# EAGLE design HenHouseControlleri2cfix (EAGLE 8.0.2)
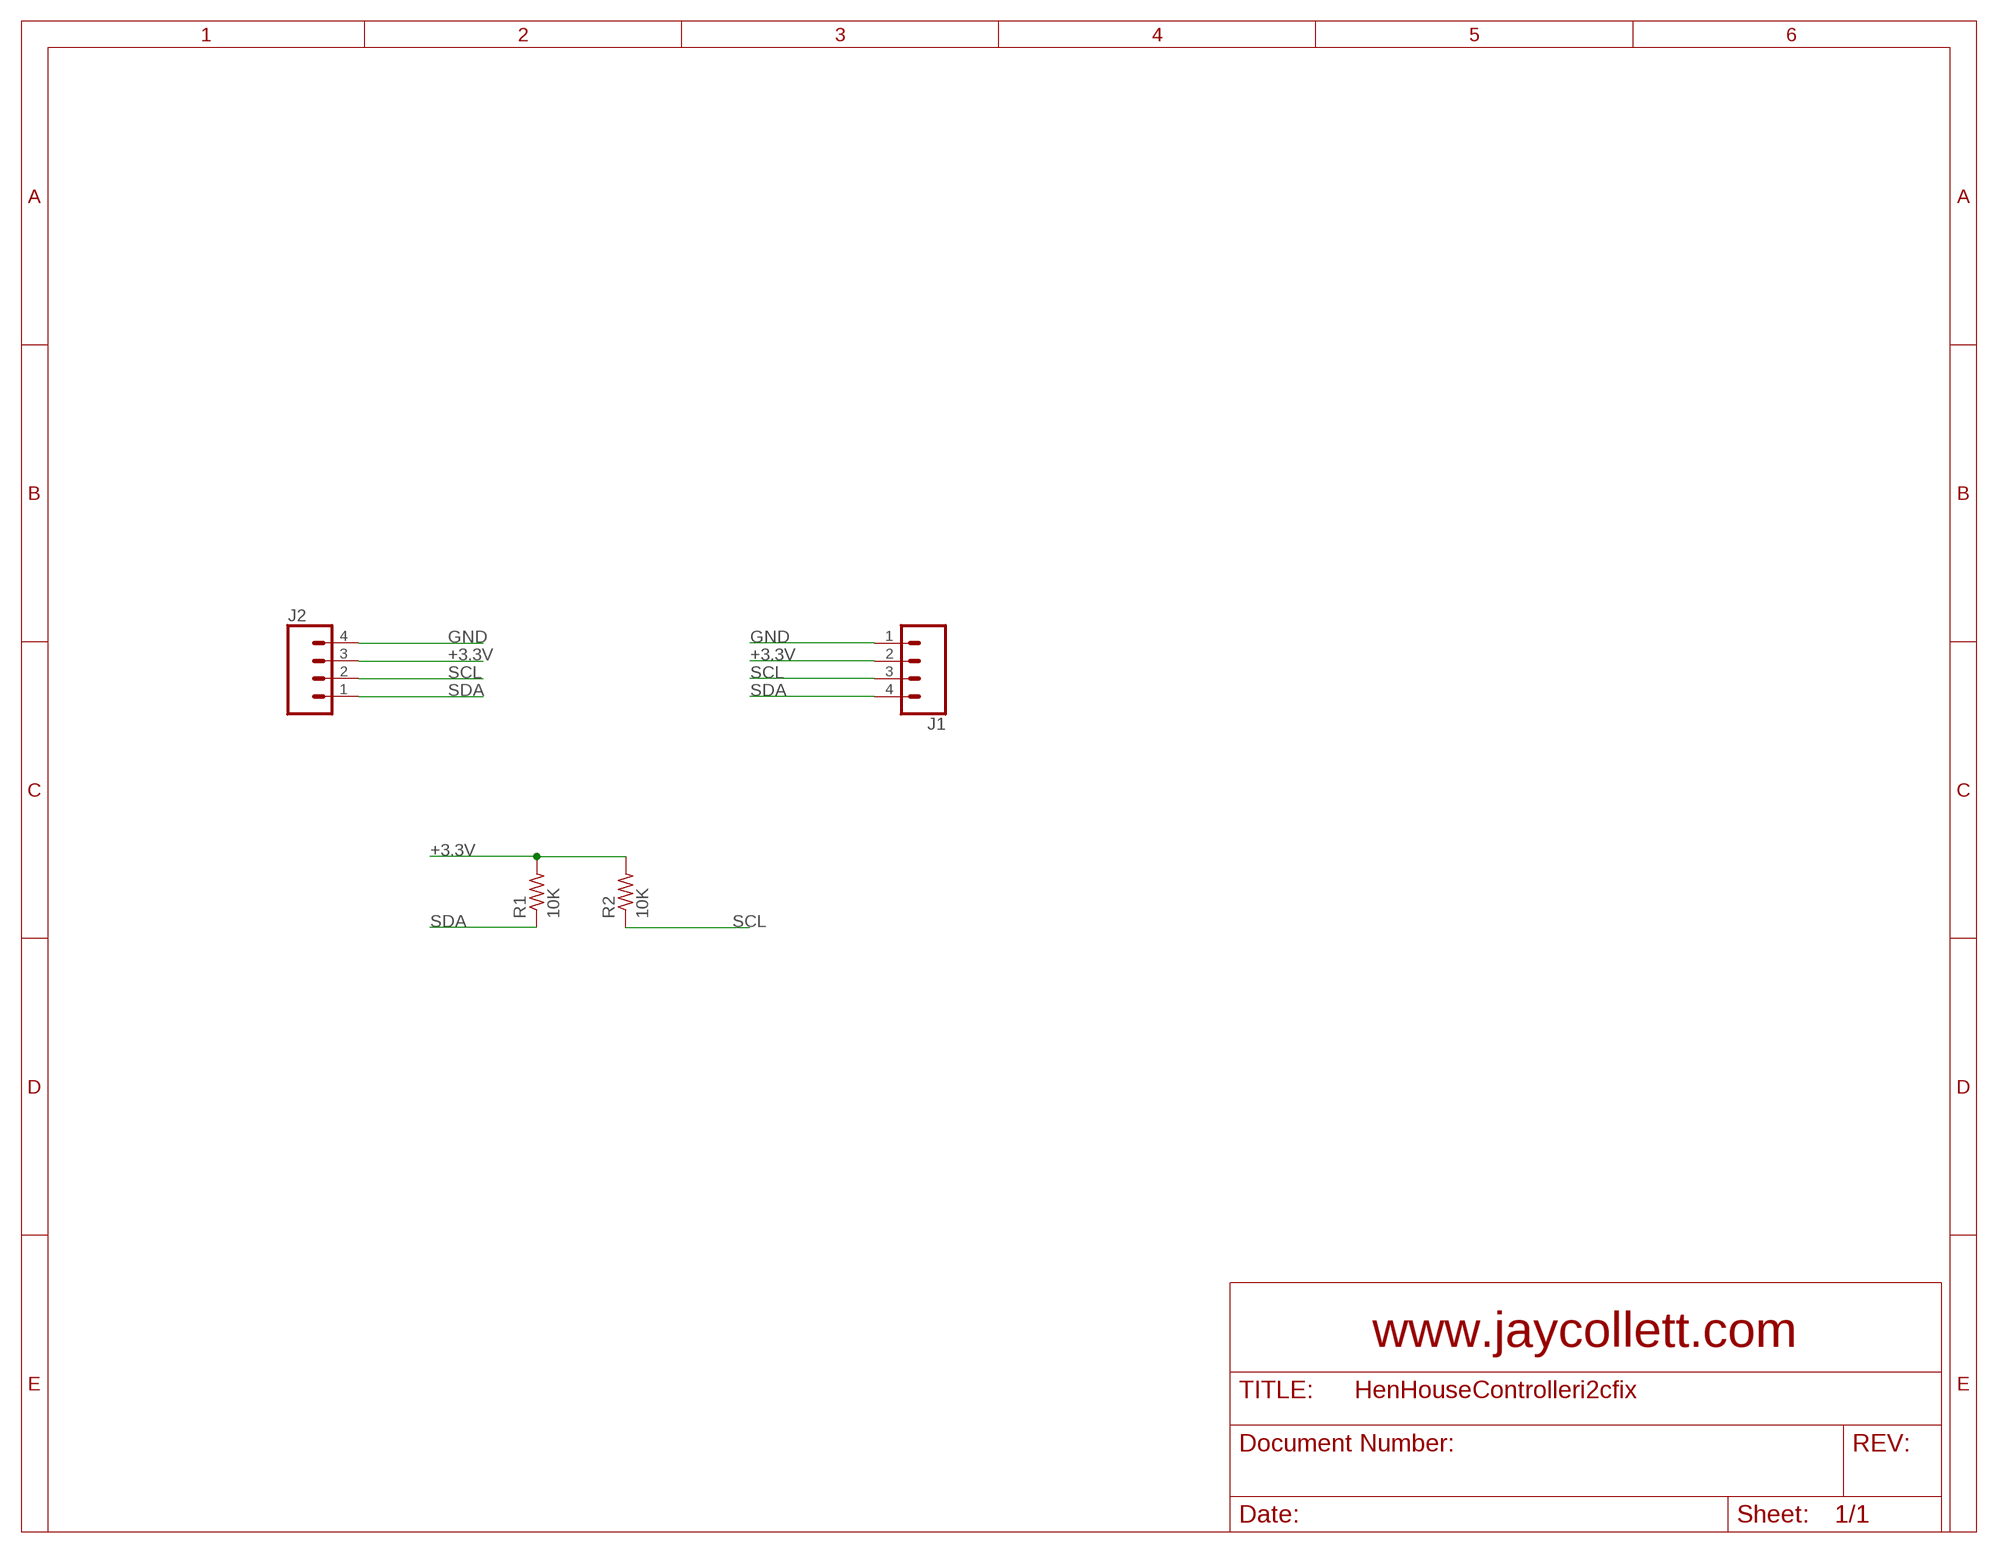
[diagram p0: schematic, sheet 1]

## Parts
J1  CONN_04LONGPADS  [1X04_LONGPADS]
J2  CONN_04LONGPADS  [1X04_LONGPADS]
R1  10K  R-US_R0805  [R0805]
R2  10K  R-US_R0805  [R0805]

## Nets
+3.3V: J1.2 J2.3 R1.2 R2.2
GND: J1.1 J2.4
SCL: J1.3 J2.2 R2.1
SDA: J1.4 J2.1 R1.1

## Notes on the sheet
- www.jaycollett.com

## Library data of the parts
J1 J2 = SparkFun-Connectors:CONN_04: Multi connection point. Often used as Generic Header-pin footprint for 0.1 inch spaced/style header connections On any of the 0.1 inch spaced packages, you can populate with these: Break Away Headers - Straight <https://www.sparkfun.com/products/116> (PRT-00116) Break Away Male Headers - Right Angle <https://www.sparkfun.com/products/553> (PRT-00553) Female Headers <https://www.sparkfun.com/products/115> (PRT-00115) Break Away Headers - Machine Pin <https://www.sparkfun.com/products/117> (PRT-00117) Break Away Female Headers - Swiss Machine Pin <https://www.sparkfun.com/products/743> (PRT-00743) For SCREWTERMINALS and SPRING TERMINALS visit here: Screw Terimnals on SparkFun.com <https://www.sparkfun.com/search/results?term=Screw+Terminals> (5mm/3.5mm/2.54mm spacing) This device is also useful as a general connection point to wire up your design to another part of your project. Our various solder wires solder well into these plated through hole pads. Hook-Up Wire - Assortment (Stranded, 22 AWG) <https://www.sparkfun.com/products/11375> (PRT-11375) Hook-Up Wire - Assortment (Solid Core, 22 AWG) <https://www.sparkfun.com/products/11367> (PRT-11367) View the entire wire category on our website here <https://www.sparkfun.com/categories/141> Special notes: Molex polarized connector foot print use with SKU : PRT-08231 with associated crimp pins and housings. 1MM SMD Version SKU: PRT-10208; PROD_ID: CONN-09696
R1 R2 = adafruit:R-US_: RESISTOR, American symbol

## Board
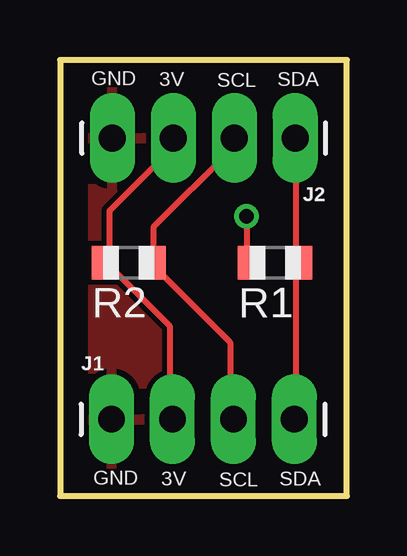
[diagram p1: board, top side]
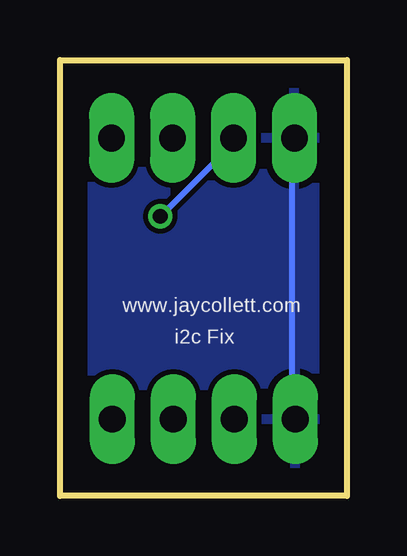
[diagram p2: board, bottom side, seen from below]

Size 11.95 x 18.18 mm. Coordinates in mm from the lower left corner, seen from the top.
Outline: 0,0 11.95,0 11.95,18.18 0,18.18 0,0
Copper layers (1*16): Top 0.035mm / dielectric 1.5mm / Bottom 0.035mm
Design rules "default": minimum track width 10mil, minimum drill 24mil, track to track 8mil, track to pad 8mil, pad to pad 8mil, via to via 8mil, smd to smd 8mil, copper to edge 40mil, drill to drill 8mil, minimum pad ring 10mil, minimum via ring 8mil, stop-mask expansion 4mil, vias tented up to drill 0mil, thermal gap 10mil

### Footprints (pad centres in the part's own frame; a part is rotated, then mirrored left to right if it is on the bottom)
1X04_LONGPADS = drill 1.118 pad 1.88 long: 1 0,0; 2 2.54,0; 3 5.08,0; 4 7.62,0
R0805 = smd 1.1 x 1.4: 1 -1,0; 2 1,0

### Placement (x,y rotation side)
J1  2.15,3.2 0 top
J2  9.8,14.92 180 top
R1  8.96,9.72 180 top
R2  2.86,9.72 180 top

### Tracks (layer width: path | path; a pad name or v marks a point on that pad's centre or on a via)
+3.3V  (via drill 0.61)
  Top 0.254: J2.3 4.57,14.86 4.57,14.4 2.06,11.89 2.06,9.83 R2.2 2.06,9.6 4.57,7.09 4.57,3.2 J1.2 | v7.77,11.66 7.77,9.83 R1.2
  Bottom 0.254: v7.77,11.66 4.57,14.86 J2.3
GND
  Bottom 0.254: J1.1 2.29,3.2 2.29,14.86 J2.4
  pour Top (isolate 0.012): 0,18 12,18 12,0 0,0
  pour Bottom (isolate 0.012): 0,18 12,18 12,0 0,0
SCL
  Top 0.254: J2.2 7.09,14.86 7.09,14.4 3.89,11.2 3.89,9.83 R2.1 3.89,9.6 7.09,6.4 7.09,3.2 J1.3
SDA
  Top 0.254: J2.1 9.83,14.86 9.83,9.83 R1.1 9.83,9.6 9.83,3.2 J1.4

### Text on the board
tPlace: GND | 3V | SCL | SDA | GND | 3V | SCL | SDA
bPlace: www.jaycollett.com | i2c Fix